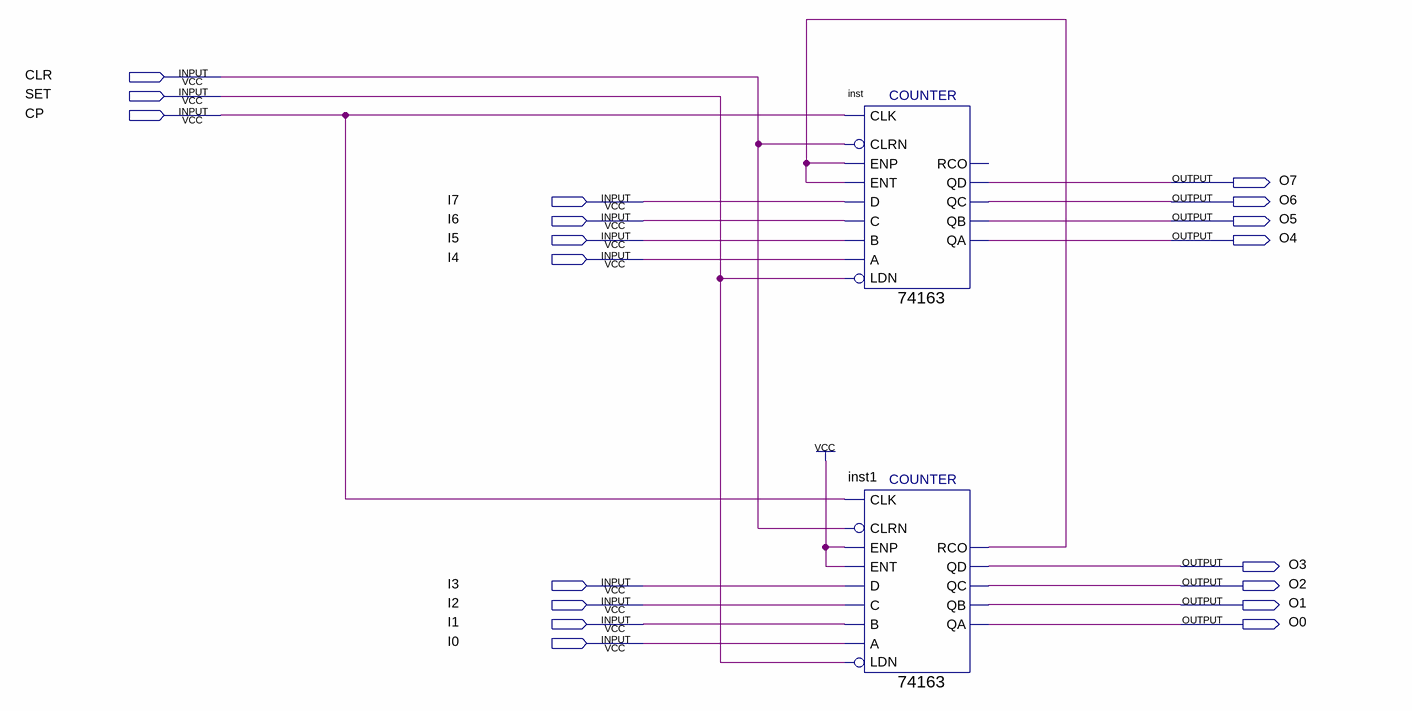
[diagram p0: schematic sheet]
// Quartus schematic counter_with_set_8_advanced.bdf as structural Verilog: 2 symbols, 19 pins
module counter_with_set_8_advanced (
  input  CLR,
  input  SET,
  input  CP,
  input  I7,
  input  I6,
  input  I5,
  input  I4,
  input  I3,
  input  I2,
  input  I1,
  input  I0,
  output O7,
  output O6,
  output O5,
  output O4,
  output O3,
  output O2,
  output O1,
  output O0
);

  wire inst1_rco;

  \74163  inst (
    .C(I6), .B(I5), .A(I4), .ENT(inst1_rco), .D(I7), .CLRN(CLR), .CLK(CP), .ENP(inst1_rco), .LDN(SET),
    .QA(O4), .QB(O5), .QC(O6), .QD(O7));  // open: RCO
  \74163  inst1 (
    .C(I2), .B(I1), .A(I0), .ENT(1'b1), .D(I3), .CLRN(CLR), .CLK(CP), .ENP(1'b1), .LDN(SET), .QA(O0),
    .QB(O1), .QC(O2), .QD(O3), .RCO(inst1_rco));
endmodule
